# Altium project PIC精简开发板.PrjPCB
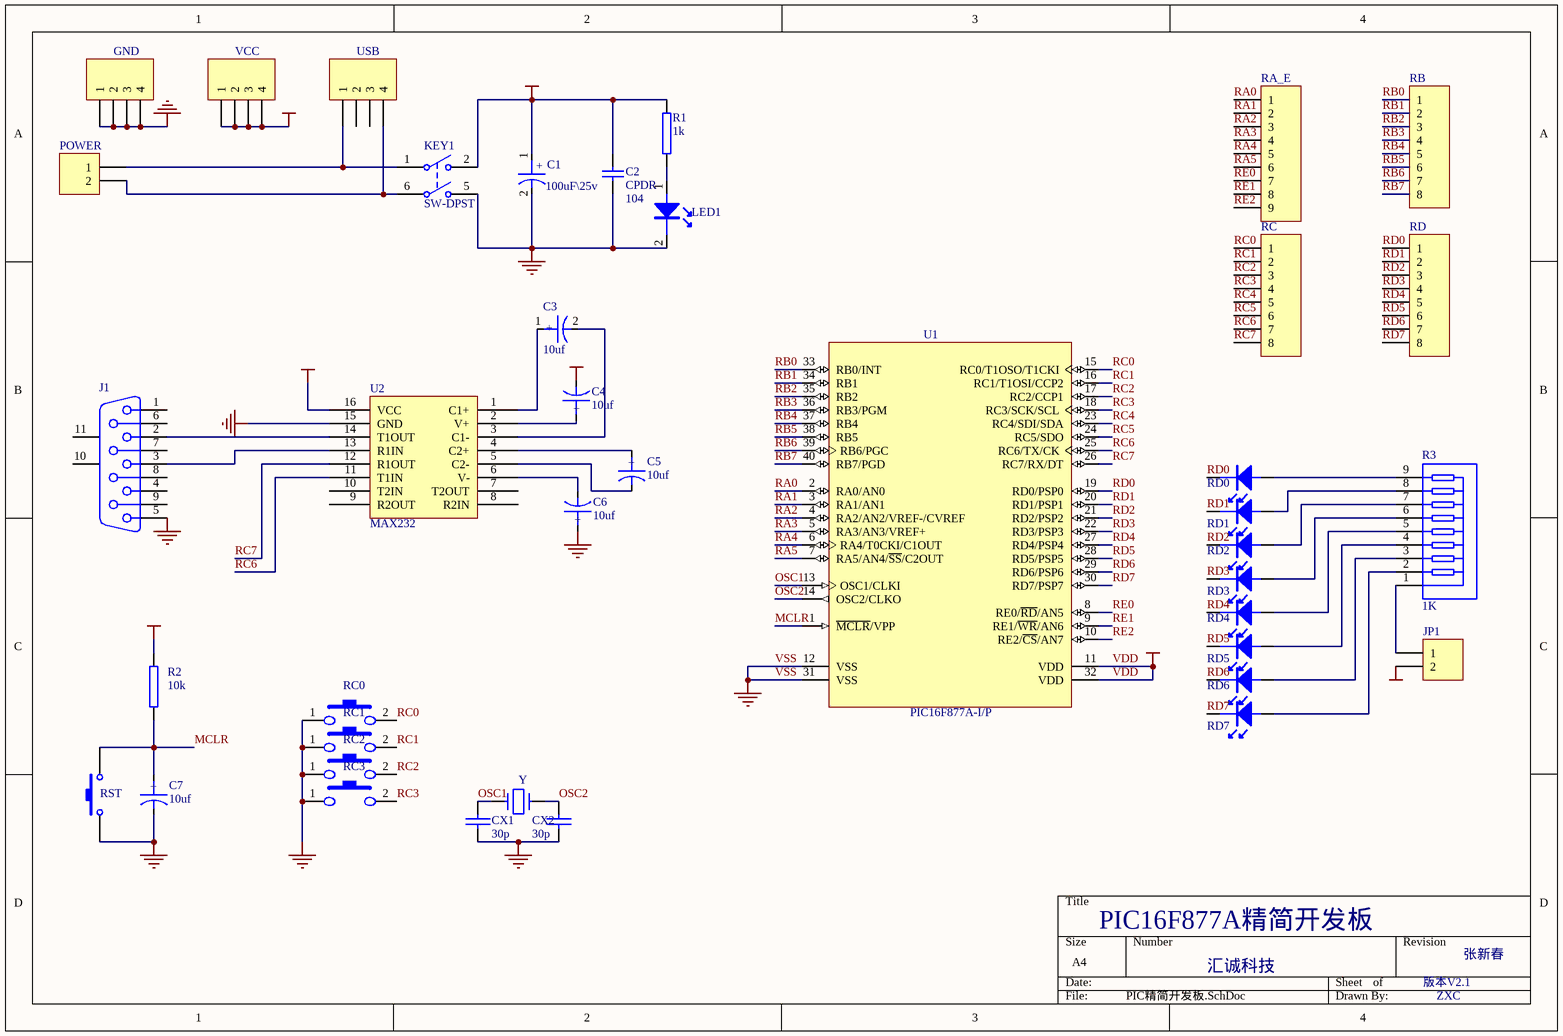
[diagram p0: PIC精简开发板.SchDoc]
1 sheet, 40 parts. Net scope: global (net labels, ports and power ports of the same name join across sheets).
Board file: PIC精简开发板.PCBDOC

## Sheet PIC精简开发板.SchDoc
size A4

### Parts
C1  100uF\25v  [C-DJ-6]
C2  CPDR  value 104  [CPDR]
C3  10uf  [C-DJ-4]
C4  10uf  [C-DJ-4]
C5  10uf  [C-DJ-4]
C6  10uf  [C-DJ-4]
C7  10uf  [C-DJ-4]
CX1  30p  [HDR1X2]
CX2  30p  [HDR1X2]
GND  (no value)  [HDR1X4]
J1  D Connector 9  [DSUB1.385-2H9]  (value not drawn)
JP1  (no value)  [HDR1X2]
KEY1  SW-DPST  [DPDT-6]
LED1  LED  [LED]  (value not drawn)
POWER  (no value)  [JK128_2]
R1  1k  [RSE]
R2  10k  [RSE]
R3  value 1K  [HDR-10]
RA_E  (no value)  [HDR-9]
RB  (no value)  [HDR-8]
RC  (no value)  [HDR-8]
RC0  key1  [an-6*6]  (value not drawn)
RC1  key2  [an-6*6]  (value not drawn)
RC2  key3  [an-6*6]  (value not drawn)
RC3  key4  [an-6*6]  (value not drawn)
RD  (no value)  [HDR-8]
RD0  LED  [LED_D]  (value not drawn)
RD1  LED  [LED_D]  (value not drawn)
RD2  LED  [LED_D]  (value not drawn)
RD3  LED  [LED_D]  (value not drawn)
RD4  LED  [LED_D]  (value not drawn)
RD5  LED  [LED_D]  (value not drawn)
RD6  LED  [LED_D]  (value not drawn)
RD7  LED  [LED_D]  (value not drawn)
RST  (no value)  [an-6*6]
U1  PIC16F877A-I/P  [AT89S52Pid]
U2  MAX232  [DIP16]
USB  (no value)  [USB-5V]
VCC  (no value)  [HDR1X4]
Y1  Y  [JZ_ZC]

### Nets
VDD: C1.1 C2.2 C4.2 JP1.2 KEY1.2(NO1) R1.1 R2.2 U1.11(VDD) U1.32(VDD) U2.16(VCC) VCC.1 VCC.2 VCC.3 VCC.4  [also labelled VCC]
VSS: C1.2 C2.1 C6.1 C7.2 CX1.2 CX2.2 GND.1 GND.2 GND.3 GND.4 J1.5 KEY1.5(NO2) LED1.2(K) RC0.1 RC1.1 RC2.1 RC3.1 RST.2 U1.12(VSS) U1.31(VSS) U2.15(GND)  [also labelled GND]
MCLR: C7.1 R2.1 RST.1 U1.1(~{MCLR}/VPP)
OSC1: CX1.1 U1.13(OSC1/CLKI) Y1.2
OSC2: CX2.1 U1.14(OSC2/CLKO) Y1.1
RA0: RA_E.1 U1.2(RA0/AN0)
RA1: RA_E.2 U1.3(RA1/AN1)
RA2: RA_E.3 U1.4(RA2/AN2/VREF-/CVREF)
RA3: RA_E.4 U1.5(RA3/AN3/VREF+)
RA4: RA_E.5 U1.6(RA4/T0CKI/C1OUT)
RA5: RA_E.6 U1.7(RA5/AN4/~{SS}/C2OUT)
RB0: RB.1 U1.33(RB0/INT)
RB1: RB.2 U1.34(RB1)
RB2: RB.3 U1.35(RB2)
RB3: RB.4 U1.36(RB3/PGM)
RB4: RB.5 U1.37(RB4)
RB5: RB.6 U1.38(RB5)
RB6: RB.7 U1.39(RB6/PGC)
RB7: RB.8 U1.40(RB7/PGD)
RC0: RC.1 RC0.2 U1.15(RC0/T1OSO/T1CKI)
RC1: RC.2 RC1.2 U1.16(RC1/T1OSI/CCP2)
RC2: RC.3 RC2.2 U1.17(RC2/CCP1)
RC3: RC.4 RC3.2 U1.18(RC3/SCK/SCL)
RC4: RC.5 U1.23(RC4/SDI/SDA)
RC5: RC.6 U1.24(RC5/SDO)
RC6: RC.7 U1.25(RC6/TX/CK) U2.11(T1IN)
RC7: RC.8 U1.26(RC7/RX/DT) U2.12(R1OUT)
RD0: RD.1 RD0.2(K) U1.19(RD0/PSP0)
RD1: RD.2 RD1.2(K) U1.20(RD1/PSP1)
RD2: RD.3 RD2.2(K) U1.21(RD2/PSP2)
RD3: RD.4 RD3.2(K) U1.22(RD3/PSP3)
RD4: RD.5 RD4.2(K) U1.27(RD4/PSP4)
RD5: RD.6 RD5.2(K) U1.28(RD5/PSP5)
RD6: RD.7 RD6.2(K) U1.29(RD6/PSP6)
RD7: RD.8 RD7.2(K) U1.30(RD7/PSP7)
RE0: RA_E.7 U1.8(RE0/~{RD}/AN5)
RE1: RA_E.8 U1.9(RE1/~{WR}/AN6)
RE2: RA_E.9 U1.10(RE2/~{CS}/AN7)
NetC3_1: C3.1 U2.1(C1+)
NetC3_2: C3.2 U2.3(C1-)
NetC4_1: C4.1 U2.2(V+)
NetC5_1: C5.1 U2.4(C2+)
NetC5_2: C5.2 U2.5(C2-)
NetC6_2: C6.2 U2.6(V-)
NetJ1_2: J1.2 U2.14(T1OUT)
NetJ1_3: J1.3 U2.13(R1IN)
NetJP1_1: JP1.1 R3.1
NetKEY1_1: KEY1.1(COMMON1) POWER.1 USB.1
NetKEY1_6: KEY1.6(COMMON2) POWER.2 USB.4
NetLED1_1: LED1.1(A) R1.2
NetR3_2: R3.2 RD7.1(A)
NetR3_3: R3.3 RD6.1(A)
NetR3_4: R3.4 RD5.1(A)
NetR3_5: R3.5 RD4.1(A)
NetR3_6: R3.6 RD3.1(A)
NetR3_7: R3.7 RD2.1(A)
NetR3_8: R3.8 RD1.1(A)
NetR3_9: R3.9 RD0.1(A)

Not connected (* = marked no-connect by the designer): J1 1 4 6 7 8 9 10(MH1) 11(MH2); U2 7(T2OUT) 8(R2IN) 9(R2OUT) 10(T2IN); USB 2 3

### Notes on the sheet
- PIC16F877A精简开发板
- 汇诚科技
- 版本V2.1
- 张新春
- ZXC
- (in symbol CAPACITOR POL) +

### Library data of the parts
C1 C3-C7 = CAPACITOR POL: Capacitor
C2 = CPDR: 瓷片电容; Published: 8-Jun-2000; LatestRevisionDate: 17-Jul-2002; LatestRevisionNote: Re-released for DXP Platform.; Publisher: Altium Limited
CX1 CX2 = CAP: Capacitor
GND USB VCC = Header 4: Header, 4-Pin; Revision: 17-Jul-2002: Re-released for DXP Platform.; Publisher: Altium Limited
J1 = D Connector 9: Receptacle Assembly, 9 Position, Right Angle; Package Information: Latest Revision: O; Positions: 9; Published: 15-Jun-2001; Revision: 17-Jul-2002: Re-released for DXP Platform.; Datasheet: (1-Sep-1999); Package Reference: 788750; Publisher: Altium Limited; Orientation: Right Angle; Gender: Receptacle
JP1 POWER = Header 2: Header, 2-Pin; LatestRevisionDate: 17-Jul-2002; LatestRevisionNote: Re-released for DXP Platform.; Publisher: Altium Limited
KEY1 = SW-DPST: Double-Pole, Single-Throw Switch; Published: 24-Mar-1999; Revision: July-2002: Re-released for DXP Platform.; Publisher: Altium Limited
R1 R2 = RES2
R3 = Res PZ_8: 8位排阻; Published: 24-Mar-1999; LatestRevisionDate: 17-Jul-2002; LatestRevisionNote: Re-released for DXP Platform.; Publisher: Altium Limited; Code_JEDEC: MO-150-AC
RA_E = PZ_9: 排针——9; LatestRevisionDate: 17-Jul-2002; LatestRevisionNote: Re-released for DXP Platform.; Publisher: Altium Limited
RB RC RD = PZ_8: 排针——8; LatestRevisionDate: 17-Jul-2002; LatestRevisionNote: Re-released for DXP Platform.; Publisher: Altium Limited
RC0-RC3 = key
RST = SW-PB: Switch; Published: 24-Mar-1999; LatestRevisionDate: 17-Jul-2002; LatestRevisionNote: Re-released for DXP Platform.; Publisher: Altium Limited
U1 = PIC16F877A-I/P: Enhanced FLASH Microcontroller, 8K (x14-Bit words) FLASH, 368 Bytes RAM, 40-Pin PDIP, Standard VDD Range, Industrial Temperature; PackageDocument: 2003; Note: 25mA sink/source per I/O.; Published: 11-Oct-2004; LatestRevisionDate: 4-Mar-2005; LatestRevisionNote: Stylized 3D Model Added.; DatasheetDocument: DS39582B_2003; PackageReference: PDIP600-40; Publisher: Altium Limited; Code_JEDEC: MO-011; ComponentLink1Description: Manufacturer Link; ComponentLink1URL: http://www.microchip.com/index.asp; ComponentLink2Description: Datasheet; ComponentLink2URL: http://ww1.microchip.com/downloads/en/DeviceDoc/39582b.pdf; ComponentLink3Description: Packaging Specification; ComponentLink3URL: http://ww1.microchip.com/downloads/en/PackagingSpec/00049AD.pdf
Y1 = CRYSTAL